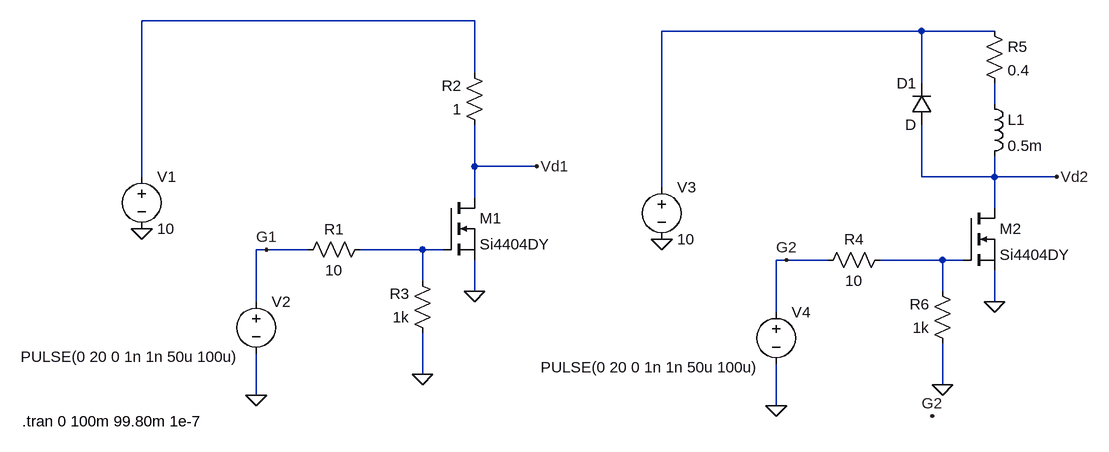
[diagram p0: schematic Draft3.asc]
Draft3.asc, the LTspice schematic file:
Version 4
SHEET 1 1504 680
WIRE 544 -144 32 -144
WIRE 1232 -128 832 -128
WIRE 1344 -128 1232 -128
WIRE 544 -64 544 -144
WIRE 1232 -48 1232 -128
WIRE 1344 -16 1344 -48
WIRE 544 80 544 16
WIRE 640 80 544 80
WIRE 32 96 32 -144
WIRE 1232 96 1232 16
WIRE 1344 96 1344 64
WIRE 1344 96 1232 96
WIRE 1440 96 1344 96
WIRE 832 112 832 -128
WIRE 544 128 544 80
WIRE 1344 144 1344 96
WIRE 224 208 208 208
WIRE 288 208 224 208
WIRE 464 208 368 208
WIRE 496 208 464 208
WIRE 1024 224 1008 224
WIRE 1088 224 1024 224
WIRE 1264 224 1168 224
WIRE 1296 224 1264 224
WIRE 464 256 464 208
WIRE 544 272 544 224
WIRE 1264 272 1264 224
WIRE 208 288 208 208
WIRE 1344 288 1344 240
WIRE 1008 304 1008 224
WIRE 464 400 464 336
WIRE 1264 416 1264 352
WIRE 208 432 208 368
WIRE 1008 448 1008 384
FLAG 32 176 0
FLAG 208 432 0
FLAG 464 400 0
FLAG 544 272 0
FLAG 640 80 Vd1
FLAG 832 192 0
FLAG 1008 448 0
FLAG 1264 416 0
FLAG 1344 288 0
FLAG 1440 96 Vd2
FLAG 224 208 G1
FLAG 1248 464 G2
FLAG 1024 224 G2
SYMBOL voltage 32 80 R0
WINDOW 123 0 0 Left 0
WINDOW 39 0 0 Left 0
SYMATTR InstName V1
SYMATTR Value 10
SYMBOL voltage 208 272 R0
WINDOW 3 -362 101 Left 2
WINDOW 123 0 0 Left 0
WINDOW 39 0 0 Left 0
SYMATTR Value PULSE(0 20 0 1n 1n 50u 100u)
SYMATTR InstName V2
SYMBOL res 384 192 R90
WINDOW 0 0 56 VBottom 2
WINDOW 3 32 56 VTop 2
SYMATTR InstName R1
SYMATTR Value 10
SYMBOL res 560 32 R180
WINDOW 0 36 76 Left 2
WINDOW 3 36 40 Left 2
SYMATTR InstName R2
SYMATTR Value 1
SYMBOL res 480 352 R180
WINDOW 0 36 76 Left 2
WINDOW 3 36 40 Left 2
SYMATTR InstName R3
SYMATTR Value 1k
SYMBOL nmos 496 128 R0
SYMATTR InstName M1
SYMATTR Value Si4404DY
SYMBOL voltage 832 96 R0
WINDOW 123 0 0 Left 0
WINDOW 39 0 0 Left 0
SYMATTR InstName V3
SYMATTR Value 10
SYMBOL voltage 1008 288 R0
WINDOW 3 -362 101 Left 2
WINDOW 123 0 0 Left 0
WINDOW 39 0 0 Left 0
SYMATTR Value PULSE(0 20 0 1n 1n 50u 100u)
SYMATTR InstName V4
SYMBOL res 1184 208 R90
WINDOW 0 0 56 VBottom 2
WINDOW 3 32 56 VTop 2
SYMATTR InstName R4
SYMATTR Value 10
SYMBOL res 1280 368 R180
WINDOW 0 36 76 Left 2
WINDOW 3 36 40 Left 2
SYMATTR InstName R6
SYMATTR Value 1k
SYMBOL nmos 1296 144 R0
SYMATTR InstName M2
SYMATTR Value Si4404DY
SYMBOL ind 1328 -32 R0
SYMATTR InstName L1
SYMATTR Value 0.5m
SYMBOL res 1328 -144 R0
SYMATTR InstName R5
SYMATTR Value 0.4
SYMBOL diode 1248 16 R180
WINDOW 0 24 64 Left 2
WINDOW 3 24 0 Left 2
SYMATTR InstName D1
TEXT -152 472 Left 2 !.tran 0 100m 99.80m 1e-7

The netlist it stands for:
* Draft3.asc
V1 N001 0 10
V2 G1 0 PULSE(0 20 0 1n 1n 50u 100u)
R1 N004 G1 10
R2 Vd1 N001 1
R3 0 N004 1k
M1 Vd1 N004 0 0 Si4404DY
V3 N002 0 10
V4 G2 0 PULSE(0 20 0 1n 1n 50u 100u)
R4 N005 G2 10
R6 0 N005 1k
M2 Vd2 N005 0 0 Si4404DY
L1 N003 Vd2 0.5m
R5 N002 N003 0.4
D1 Vd2 N002 D
.model D D
.lib standard.dio
.model NMOS NMOS
.model PMOS PMOS
.lib standard.mos
.tran 0 100m 99.80m 1e-7
.backanno
.end